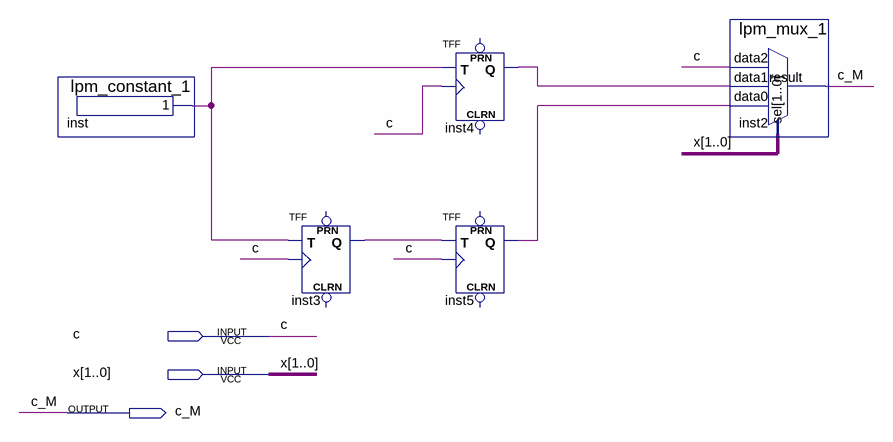
[diagram p0: schematic sheet]
// Quartus schematic tact_consume_scheme.bdf as structural Verilog: 5 symbols, 3 pins
module tact_consume_scheme (
  input  c,
  input  [1:0] x,
  output c_M
);

  wire inst3_q, inst4_q, inst5_q, inst_result;

  lpm_constant_1 inst (.result(inst_result));
  TFF inst3 (.T(inst_result), .CLK(c), .Q(inst3_q));  // open: PRN, CLRN
  TFF inst4 (.T(inst_result), .CLK(c), .Q(inst4_q));  // open: PRN, CLRN
  TFF inst5 (.T(inst3_q), .CLK(c), .Q(inst5_q));  // open: PRN, CLRN
  lpm_mux_1 inst2 (.data2(c), .data1(inst4_q), .data0(inst5_q), .sel(x), .result(c_M));
endmodule
